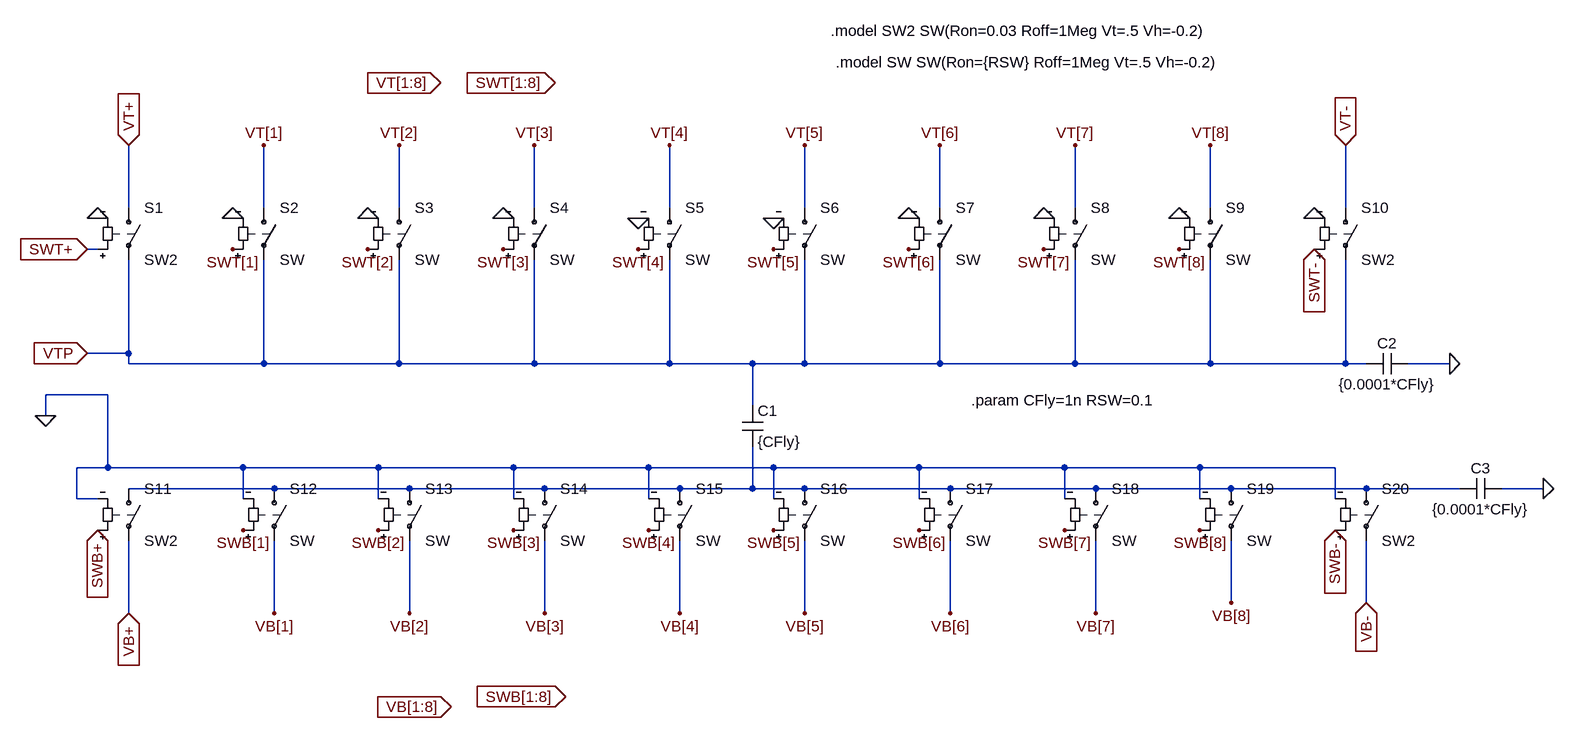
[diagram p0: schematic contRatioCore.asc]
contRatioCore.asc, the LTspice schematic file:
Version 4
SHEET 1 2356 940
WIRE 144 112 144 16
WIRE 352 112 352 16
WIRE 560 112 560 16
WIRE 768 112 768 16
WIRE 976 112 976 16
WIRE 1184 112 1184 16
WIRE 1392 112 1392 16
WIRE 1600 112 1600 16
WIRE 1808 112 1808 16
WIRE 2016 112 2016 16
WIRE 944 128 928 128
WIRE 1152 128 1136 128
WIRE 96 176 80 176
WIRE 528 176 512 176
WIRE 1152 176 1136 176
WIRE 1776 176 1760 176
WIRE 144 336 144 192
WIRE 144 336 80 336
WIRE 144 352 144 336
WIRE 352 352 352 192
WIRE 352 352 144 352
WIRE 560 352 560 192
WIRE 560 352 352 352
WIRE 768 352 768 192
WIRE 768 352 560 352
WIRE 976 352 976 192
WIRE 976 352 768 352
WIRE 1104 352 976 352
WIRE 1184 352 1184 192
WIRE 1184 352 1104 352
WIRE 1392 352 1392 192
WIRE 1392 352 1184 352
WIRE 1600 352 1600 192
WIRE 1600 352 1392 352
WIRE 1808 352 1808 192
WIRE 1808 352 1600 352
WIRE 2016 352 2016 192
WIRE 2016 352 1808 352
WIRE 2048 352 2016 352
WIRE 2176 352 2112 352
WIRE 112 400 16 400
WIRE 1104 416 1104 352
WIRE 16 432 16 400
WIRE 112 512 112 400
WIRE 112 512 64 512
WIRE 320 512 112 512
WIRE 528 512 320 512
WIRE 736 512 528 512
WIRE 944 512 736 512
WIRE 1136 512 944 512
WIRE 1360 512 1136 512
WIRE 1584 512 1360 512
WIRE 1792 512 1584 512
WIRE 2000 512 1792 512
WIRE 368 544 144 544
WIRE 576 544 368 544
WIRE 784 544 576 544
WIRE 992 544 784 544
WIRE 1104 544 1104 480
WIRE 1104 544 992 544
WIRE 1184 544 1104 544
WIRE 1408 544 1184 544
WIRE 1632 544 1408 544
WIRE 1840 544 1632 544
WIRE 2048 544 1840 544
WIRE 2192 544 2048 544
WIRE 2320 544 2256 544
WIRE 64 560 64 512
WIRE 96 560 64 560
WIRE 320 560 320 512
WIRE 528 560 528 512
WIRE 736 560 736 512
WIRE 944 560 944 512
WIRE 1136 560 1136 512
WIRE 1360 560 1360 512
WIRE 1584 560 1584 512
WIRE 1792 560 1792 512
WIRE 2000 560 2000 512
WIRE 1840 720 1840 624
WIRE 2048 720 2048 624
WIRE 144 736 144 624
WIRE 368 736 368 624
WIRE 576 736 576 624
WIRE 784 736 784 624
WIRE 992 736 992 624
WIRE 1184 736 1184 624
WIRE 1408 736 1408 624
WIRE 1632 736 1632 624
FLAG 80 176 SWT+
IOPIN 80 176 In
FLAG 96 608 SWB+
IOPIN 96 608 In
FLAG 320 608 SWB[1]
FLAG 2000 608 SWB-
IOPIN 2000 608 In
FLAG 144 736 VB+
IOPIN 144 736 In
FLAG 2048 720 VB-
IOPIN 2048 720 In
FLAG 368 736 VB[1]
FLAG 576 736 VB[2]
FLAG 784 736 VB[3]
FLAG 992 736 VB[4]
FLAG 1184 736 VB[5]
FLAG 1408 736 VB[6]
FLAG 1632 736 VB[7]
FLAG 1840 720 VB[8]
FLAG 144 16 VT+
IOPIN 144 16 In
FLAG 352 16 VT[1]
FLAG 560 16 VT[2]
FLAG 2016 16 VT-
IOPIN 2016 16 In
FLAG 16 432 0
FLAG 768 16 VT[3]
FLAG 976 16 VT[4]
FLAG 1184 16 VT[5]
FLAG 1392 16 VT[6]
FLAG 1600 16 VT[7]
FLAG 1808 16 VT[8]
FLAG 304 176 SWT[1]
FLAG 512 176 SWT[2]
FLAG 720 176 SWT[3]
FLAG 928 176 SWT[4]
FLAG 1136 176 SWT[5]
FLAG 1344 176 SWT[6]
FLAG 1552 176 SWT[7]
FLAG 1760 176 SWT[8]
FLAG 1968 176 SWT-
IOPIN 1968 176 In
FLAG 528 608 SWB[2]
FLAG 736 608 SWB[3]
FLAG 944 608 SWB[4]
FLAG 1136 608 SWB[5]
FLAG 1360 608 SWB[6]
FLAG 1584 608 SWB[7]
FLAG 1792 608 SWB[8]
FLAG 640 880 VB[1:8]
IOPIN 640 880 In
FLAG 816 864 SWB[1:8]
IOPIN 816 864 In
FLAG 800 -80 SWT[1:8]
IOPIN 800 -80 In
FLAG 624 -80 VT[1:8]
IOPIN 624 -80 In
FLAG 80 336 VTP
IOPIN 80 336 In
FLAG 96 128 0
FLAG 304 128 0
FLAG 512 128 0
FLAG 720 128 0
FLAG 928 128 0
FLAG 1136 128 0
FLAG 1344 128 0
FLAG 1552 128 0
FLAG 1760 128 0
FLAG 1968 128 0
FLAG 2176 352 0
FLAG 2320 544 0
SYMBOL sw 144 96 R0
SYMATTR InstName S1
SYMATTR Value SW2
SYMBOL sw 352 96 R0
SYMATTR InstName S2
SYMBOL sw 560 96 R0
SYMATTR InstName S3
SYMBOL sw 768 96 R0
SYMATTR InstName S4
SYMBOL sw 976 96 R0
SYMATTR InstName S5
SYMBOL sw 1184 96 R0
SYMATTR InstName S6
SYMBOL sw 1392 96 R0
SYMATTR InstName S7
SYMBOL sw 1600 96 R0
SYMATTR InstName S8
SYMBOL sw 1808 96 R0
SYMATTR InstName S9
SYMBOL sw 2016 96 R0
SYMATTR InstName S10
SYMATTR Value SW2
SYMBOL sw 144 528 R0
SYMATTR InstName S11
SYMATTR Value SW2
SYMBOL sw 368 528 R0
SYMATTR InstName S12
SYMBOL sw 576 528 R0
SYMATTR InstName S13
SYMBOL sw 784 528 R0
SYMATTR InstName S14
SYMBOL sw 992 528 R0
SYMATTR InstName S15
SYMBOL sw 1184 528 R0
SYMATTR InstName S16
SYMBOL sw 1408 528 R0
SYMATTR InstName S17
SYMBOL sw 1632 528 R0
SYMATTR InstName S18
SYMBOL sw 1840 528 R0
SYMATTR InstName S19
SYMBOL sw 2048 528 R0
SYMATTR InstName S20
SYMATTR Value SW2
SYMBOL cap 1088 416 R0
SYMATTR InstName C1
SYMATTR Value {CFly}
SYMBOL cap 2112 336 R90
WINDOW 0 0 32 VBottom 2
WINDOW 3 32 32 VTop 2
SYMATTR InstName C2
SYMATTR Value {0.0001*CFly}
SYMBOL cap 2256 528 R90
WINDOW 0 0 32 VBottom 2
WINDOW 3 32 32 VTop 2
SYMATTR InstName C3
SYMATTR Value {0.0001*CFly}
TEXT 1440 408 Left 2 !.param CFly=1n RSW=0.1
TEXT 1224 -160 Left 2 !.model SW2 SW(Ron=0.03 Roff=1Meg Vt=.5 Vh=-0.2)
TEXT 1232 -112 Left 2 !.model SW SW(Ron={RSW} Roff=1Meg Vt=.5 Vh=-0.2)

The netlist it stands for:
* contRatioCore.asc
S1 VT+ VTP SWT+ 0 SW2
S2 VT[1] VTP SWT[1] 0 SW
S3 VT[2] VTP SWT[2] 0 SW
S4 VT[3] VTP SWT[3] 0 SW
S5 VT[4] VTP SWT[4] 0 SW
S6 VT[5] VTP SWT[5] 0 SW
S7 VT[6] VTP SWT[6] 0 SW
S8 VT[7] VTP SWT[7] 0 SW
S9 VT[8] VTP SWT[8] 0 SW
S10 VT- VTP SWT- 0 SW2
S11 N001 VB+ SWB+ 0 SW2
S12 N001 VB[1] SWB[1] 0 SW
S13 N001 VB[2] SWB[2] 0 SW
S14 N001 VB[3] SWB[3] 0 SW
S15 N001 VB[4] SWB[4] 0 SW
S16 N001 VB[5] SWB[5] 0 SW
S17 N001 VB[6] SWB[6] 0 SW
S18 N001 VB[7] SWB[7] 0 SW
S19 N001 VB[8] SWB[8] 0 SW
S20 N001 VB- SWB- 0 SW2
C1 VTP N001 {CFly}
C2 0 VTP {0.0001*CFly}
C3 0 N001 {0.0001*CFly}
.param CFly=1n RSW=0.1
.model SW2 SW(Ron=0.03 Roff=1Meg Vt=.5 Vh=-0.2)
.model SW SW(Ron={RSW} Roff=1Meg Vt=.5 Vh=-0.2)
.backanno
.end